# Altium schematic sheet 74HC245.SchDoc
size A4
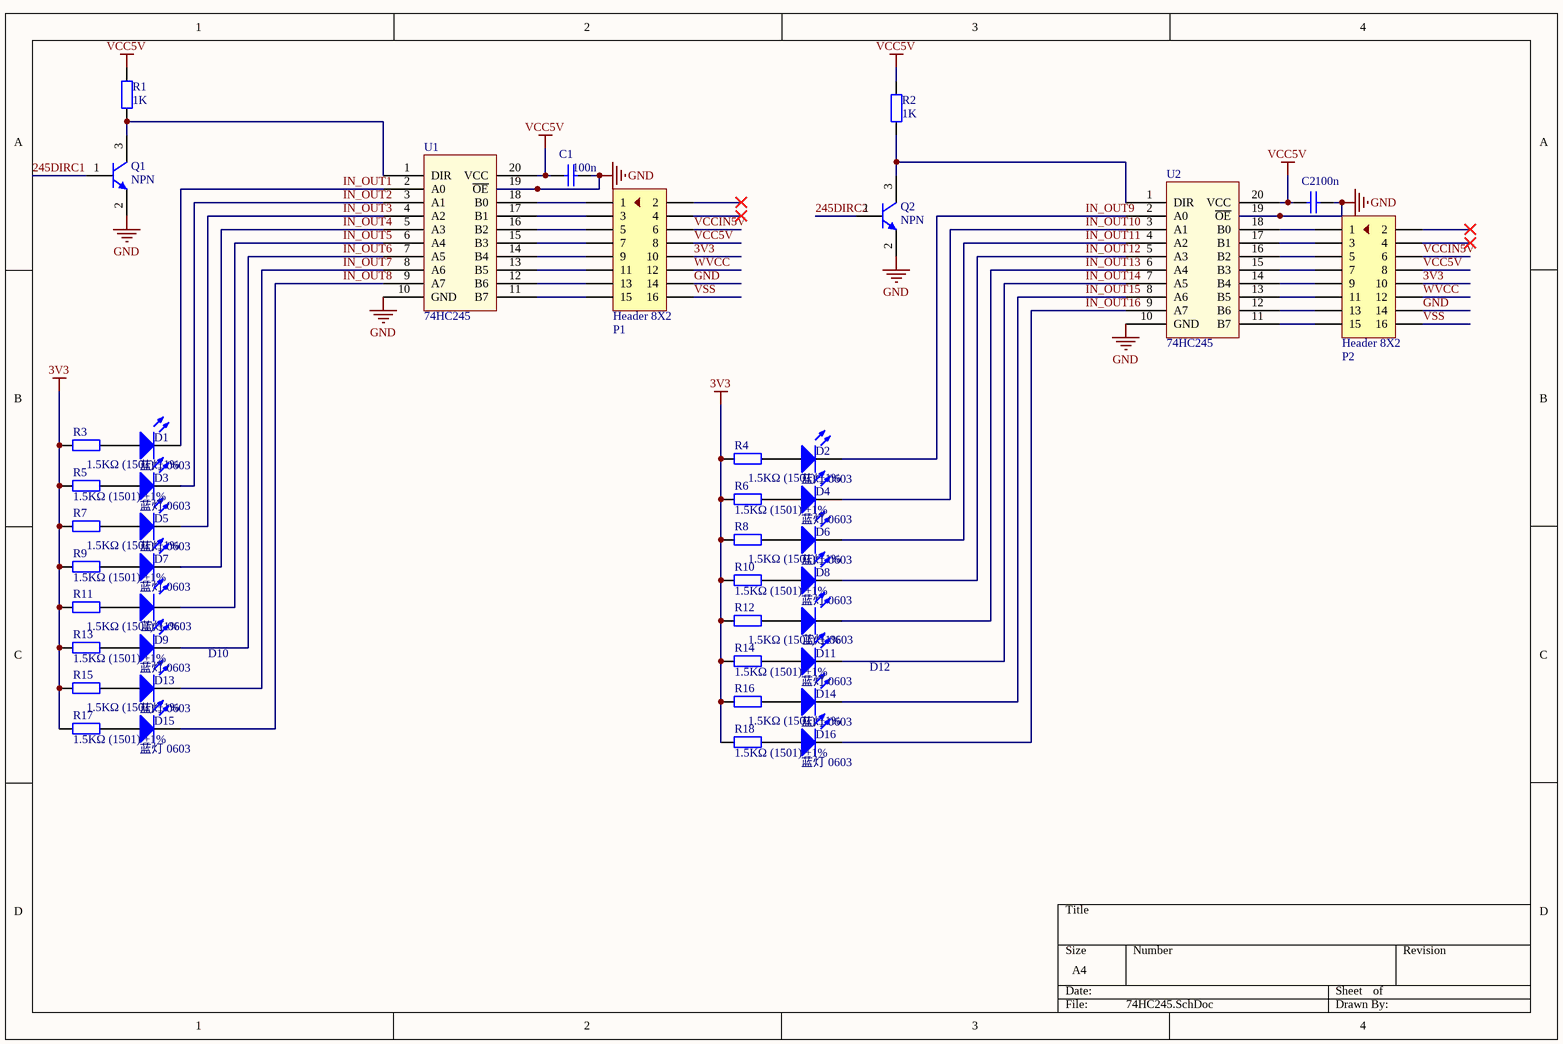
[diagram p0: 74HC245.SchDoc]

## Parts
C1  value 100n  [LC-0603_C]  (hidden comment: 104)
C2  value 100n  [LC-0603_C]  (hidden comment: 104)
D1  蓝灯 0603  [LC-0603_LED_S1]
D2  蓝灯 0603  [LC-0603_LED_S1]
D3  蓝灯 0603  [LC-0603_LED_S1]
D4  蓝灯 0603  [LC-0603_LED_S1]
D5  蓝灯 0603  [LC-0603_LED_S1]
D6  蓝灯 0603  [LC-0603_LED_S1]
D7  蓝灯 0603  [LC-0603_LED_S1]
D8  蓝灯 0603  [LC-0603_LED_S1]
D9  蓝灯 0603  [LC-0603_LED_S1]
D10  蓝灯 0603  [LC-0603_LED_S1]
D11  蓝灯 0603  [LC-0603_LED_S1]
D12  蓝灯 0603  [LC-0603_LED_S1]
D13  蓝灯 0603  [LC-0603_LED_S1]
D14  蓝灯 0603  [LC-0603_LED_S1]
D15  蓝灯 0603  [LC-0603_LED_S1]
D16  蓝灯 0603  [LC-0603_LED_S1]
P1  Header 8X2  [DC3-16P-2.54mm]
P2  Header 8X2  [DC3-16P-2.54mm]
Q1  NPN  [SOT23-3]
Q2  NPN  [SOT23-3]
R1  value 1K  [0603-1]  (hidden comment: Res1)
R2  value 1K  [0603-1]  (hidden comment: Res1)
R3  1.5KΩ (1501) ±1%  [LC-0603_R]
R4  1.5KΩ (1501) ±1%  [LC-0603_R]
R5  1.5KΩ (1501) ±1%  [LC-0603_R]
R6  1.5KΩ (1501) ±1%  [LC-0603_R]
R7  1.5KΩ (1501) ±1%  [LC-0603_R]
R8  1.5KΩ (1501) ±1%  [LC-0603_R]
R9  1.5KΩ (1501) ±1%  [LC-0603_R]
R10  1.5KΩ (1501) ±1%  [LC-0603_R]
R11  1.5KΩ (1501) ±1%  [LC-0603_R]
R12  1.5KΩ (1501) ±1%  [LC-0603_R]
R13  1.5KΩ (1501) ±1%  [LC-0603_R]
R14  1.5KΩ (1501) ±1%  [LC-0603_R]
R15  1.5KΩ (1501) ±1%  [LC-0603_R]
R16  1.5KΩ (1501) ±1%  [LC-0603_R]
R17  1.5KΩ (1501) ±1%  [LC-0603_R]
R18  1.5KΩ (1501) ±1%  [LC-0603_R]
U1  74HC245  [LC-TSSOP-20]
U2  74HC245  [LC-TSSOP-20]

## Nets
3V3: P1.10 P2.10 R3.1 R4.1 R5.1 R6.1 R7.1 R8.1 R9.1 R10.1 R11.1 R12.1 R13.1 R14.1 R15.1 R16.1 R17.1 R18.1
GND: C1.1 C2.1 P1.14 P2.14 Q1.2(E) Q2.2(E) U1.10(GND) U1.19(~{OE}) U2.10(GND) U2.19(~{OE})
VCC5V: C1.2 C2.2 P1.8 P2.8 R1.2 R2.2 U1.20(VCC) U2.20(VCC)
245DIRC1: Q1.1(B)
245DIRC2: Q2.1(B)
IN_OUT1: D1.K U1.2(A0)
IN_OUT2: D3.K U1.3(A1)
IN_OUT3: D5.K U1.4(A2)
IN_OUT4: D7.K U1.5(A3)
IN_OUT5: D10.K U1.6(A4)
IN_OUT6: D9.K U1.7(A5)
IN_OUT7: D13.K U1.8(A6)
IN_OUT8: D15.K U1.9(A7)
IN_OUT9: D2.K U2.2(A0)
IN_OUT10: D4.K U2.3(A1)
IN_OUT11: D6.K U2.4(A2)
IN_OUT12: D8.K U2.5(A3)
IN_OUT13: D12.K U2.6(A4)
IN_OUT14: D11.K U2.7(A5)
IN_OUT15: D14.K U2.8(A6)
IN_OUT16: D16.K U2.9(A7)
VCCIN5V: P1.6 P2.6
VSS: P1.16 P2.16
WVCC: P1.12 P2.12
NetD1_A: D1.A R3.2
NetD2_A: D2.A R4.2
NetD3_A: D3.A R5.2
NetD4_A: D4.A R6.2
NetD5_A: D5.A R7.2
NetD6_A: D6.A R8.2
NetD7_A: D7.A R9.2
NetD8_A: D8.A R10.2
NetD9_A: D9.A R13.2
NetD10_A: D10.A R11.2
NetD11_A: D11.A R14.2
NetD12_A: D12.A R12.2
NetD13_A: D13.A R15.2
NetD14_A: D14.A R16.2
NetD15_A: D15.A R17.2
NetD16_A: D16.A R18.2
NetP1_1: P1.1 U1.18(B0)
NetP1_3: P1.3 U1.17(B1)
NetP1_5: P1.5 U1.16(B2)
NetP1_7: P1.7 U1.15(B3)
NetP1_9: P1.9 U1.14(B4)
NetP1_11: P1.11 U1.13(B5)
NetP1_13: P1.13 U1.12(B6)
NetP1_15: P1.15 U1.11(B7)
NetP2_1: P2.1 U2.18(B0)
NetP2_3: P2.3 U2.17(B1)
NetP2_5: P2.5 U2.16(B2)
NetP2_7: P2.7 U2.15(B3)
NetP2_9: P2.9 U2.14(B4)
NetP2_11: P2.11 U2.13(B5)
NetP2_13: P2.13 U2.12(B6)
NetP2_15: P2.15 U2.11(B7)
NetQ1_3: Q1.3(C) R1.1 U1.1(DIR)
NetQ2_3: Q2.3(C) R2.1 U2.1(DIR)

Not connected (* = marked no-connect by the designer): P1 2* 4*; P2 2* 4*

## Library data of the parts
C1 C2 = Cap: Capacitor; Published: 8-Jun-2000; LatestRevisionDate: 17-Jul-2002; LatestRevisionNote: Re-released for DXP Platform.; PackageReference: RAD-0.3; Publisher: Altium Limited
D1-D16 = 0603 蓝灯: 发光二极管; ComponentLink1Description: 供应商链接; ComponentLink1URL: http://www.szlcsc.com/product/details_73150.html; Package: 0603; Supplier: LC; SuppliersPartNumber: C72041
P1 P2 = Header 8X2: 接插件; LatestRevisionDate: 17-Jul-2002; LatestRevisionNote: Re-released for DXP Platform.; Publisher: Altium Limited
Q1 Q2 = NPN1: 贴片三极管; Published: 8-Jun-2000; LatestRevisionDate: 15-Jan-2003; LatestRevisionNote: PCB Footprint 'BCY-W3/D4.7' replaced; DatasheetDocument: 1997; PackageDocument: Sep-1998; PackageReference: TO-92A; Publisher: Altium Limited; Code_JEDEC: TO-92A; ComponentLink1Description: Manufacturer Link; ComponentLink1URL: http://www.fairchildsemi.com/; ComponentLink2Description: Datasheet; ComponentLink2URL: http://www.fairchildsemi.com/ds/2N%2F2N3904.pdf
R1 R2 = Res1: 贴片电阻; Published: 8-Jun-2000; LatestRevisionDate: 17-Jul-2002; LatestRevisionNote: Re-released for DXP Platform.; PackageReference: AXIAL-0.4; Publisher: Altium Limited
R3-R18 = 0603 1.5KΩ (1501) 1%: 贴片电阻; ComponentLink1Description: 供应商链接; ComponentLink1URL: http://www.szlcsc.com/product/details_23570.html; Package: 0603; Supplier: LC; SuppliersPartNumber: C22843
U1 U2 = 7